# EAGLE design Kombisensor_UP_BA (EAGLE 5.00)
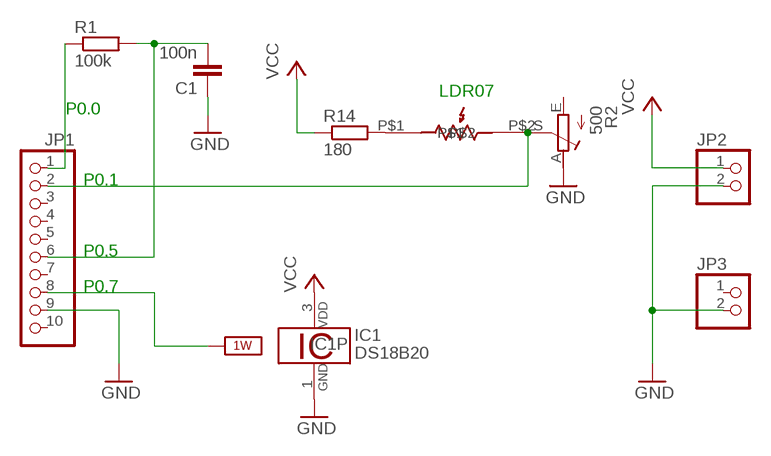
[diagram p0: schematic, sheet 1]

## Parts
C1  100n  C-EU050-024X044  [C050-024X044]
IC1  DS18B20  [TO92-]
JP1  PINHD-1X10  [1X10]
JP2  PINHD-1X2  [1X02]
JP3  PINHD-1X2  [1X02]
LDR1  LDR07  [LDR07]
R1  100k  R-EU_0207/10  [0207/10@1]
R2  500  R-TRIMM-PT6L  [PT6L]
R14  180  R-EU_0207/10  [0207/10@1]

## Nets
1W: JP1.8 ; supply symbol labelled 1W_SUP
GND: C1.1 IC1.1 JP1.9 JP2.2 JP3.2 R2.A
N$1: C1.2 JP1.6 R1.2
N$2: JP1.2 LDR1.P$2 R2.S
N$3: JP1.1 R1.1
N$4: LDR1.P$1 R14.2
VCC: IC1.3 JP2.1 R14.1
Unconnected: JP1.3 JP1.4 JP1.5 JP1.7 JP1.10 JP3.1 R2.E

## Notes on the sheet
- LDR07
- P0.0
- P0.1
- P0.5
- P0.7

## Power pins joined to a net without a drawn wire
1W: IC1.2

## Library data of the parts
C1 = rcl:C-EU: CAPACITOR, European symbol
IC1 = 1wire:DS18B20: Programmable Resolution Digital Thermometer This chip provides a onewire thermosensor with approx. 0.5°C accuracy. A programmable over/undertemperure alarm is available. The precision can be set from 9..12 bits. Notes: Vdd must be applied for accurate measurements at low temperatures, as the parasite power circuit otherwise heats the sensor. If parasite power is used, Vdd has to be connected to GND. The DS1822 is a low-cost thermometer chip, the DS18S20 is similar to the DS18B20, but with 9 Bit precision only. Author: Jan Kandziora <jjj@gmx.de>
JP1 = pinhead:PINHD-1X10: PIN HEADER
JP2 JP3 = pinhead:PINHD-1X2: PIN HEADER
LDR1 = ldr:LDR07
R1 R14 = rcl:R-EU_: RESISTOR, European symbol
R2 = kubi:R-TRIMM

## Board
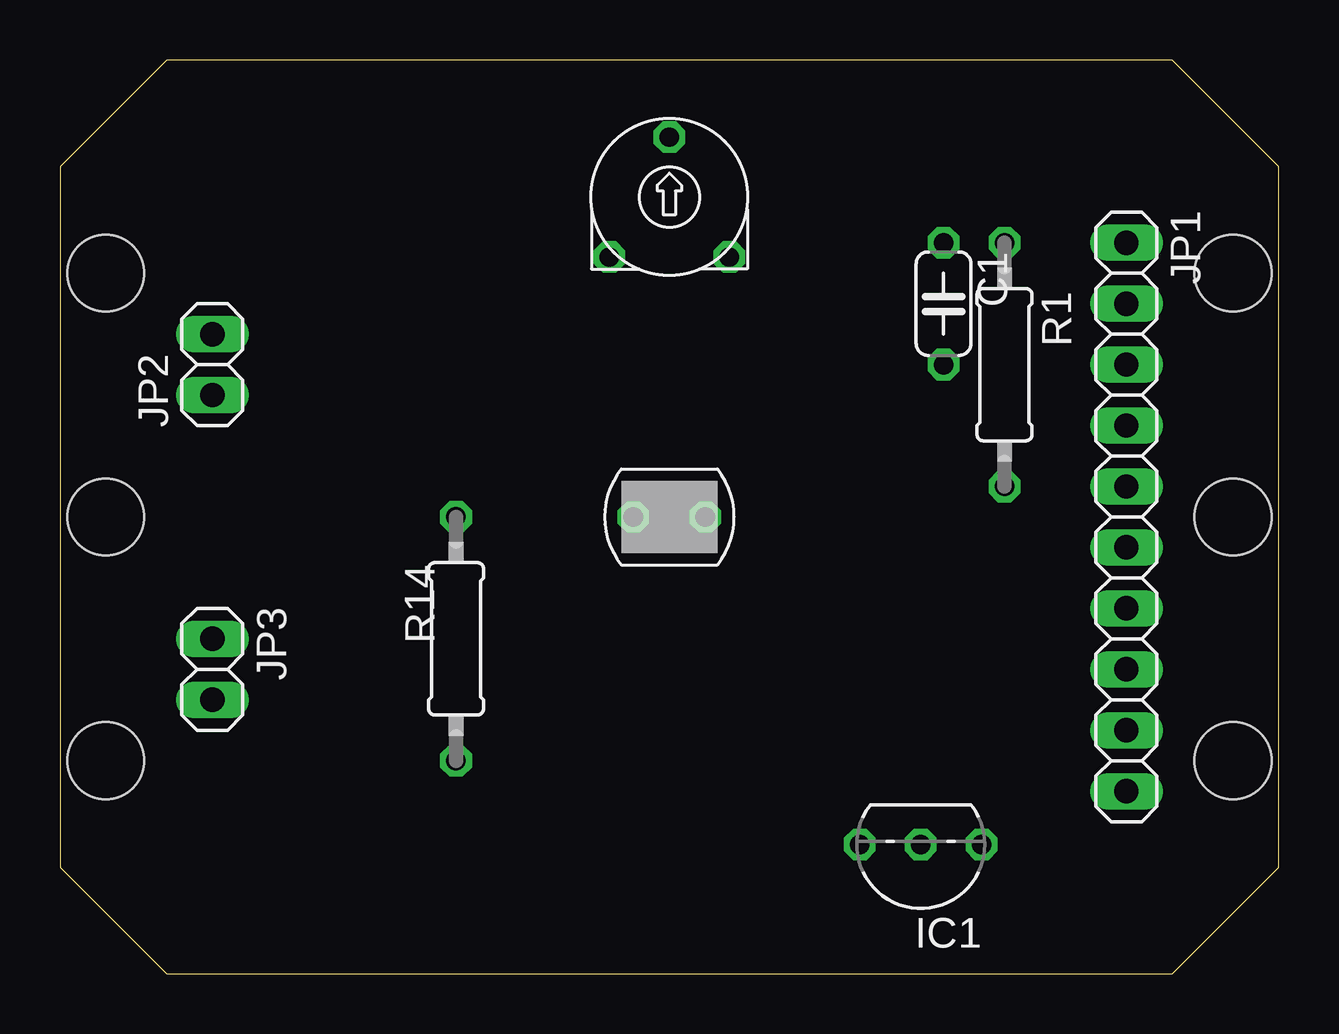
[diagram p1: board, top side]
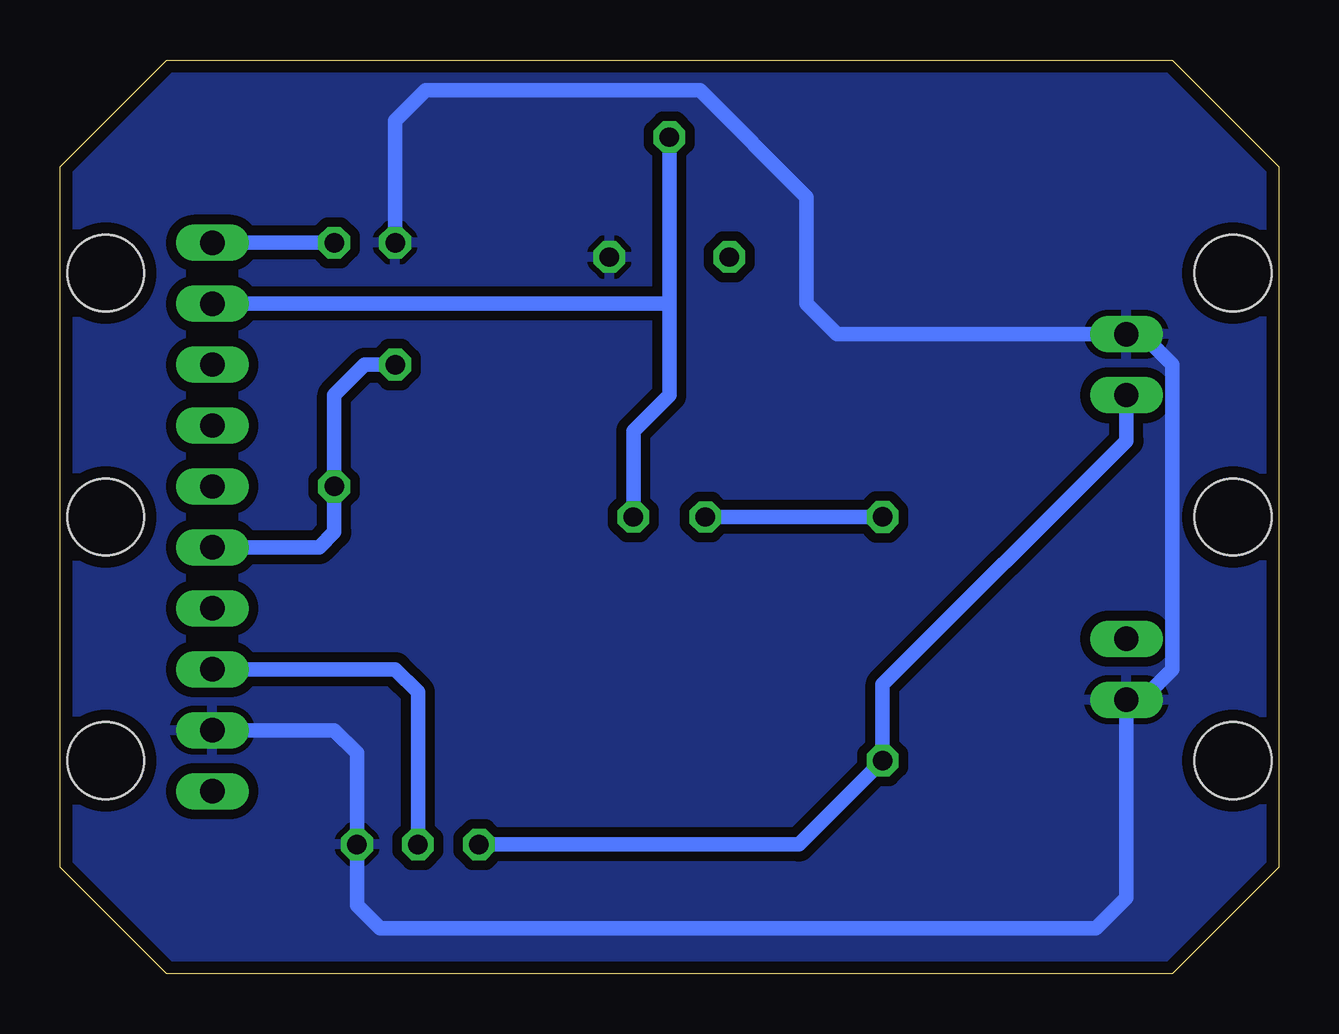
[diagram p2: board, bottom side, seen from below]

Size 50.8 x 38.1 mm. Coordinates in mm from the lower left corner, seen from the top.
Outline: 0,4.45 4.45,0 46.35,0 50.8,4.45 50.8,33.66 46.35,38.1 4.45,38.1 0,33.66 0,4.45
Copper layers (1*16): Top 0.035mm / dielectric 1.5mm / Bottom 0.035mm
Design rules "default *": minimum track width 10mil, minimum drill 24mil, track to track 16mil, track to pad 16mil, pad to pad 16mil, via to via 16mil, smd to smd 8mil, copper to edge 20mil, drill to drill 8mil, minimum pad ring 10mil, minimum via ring 8mil, stop-mask expansion 4mil, vias tented up to drill 0mil, thermal gap 10mil
Holes 3.2 mm at 1.91,19.05 1.91,29.21 1.91,8.89 48.9,19.05 48.9,29.21 48.9,8.89

### Footprints (pad centres in the part's own frame; a part is rotated, then mirrored left to right if it is on the bottom)
C050-024X044 = drill 0.813 octagon: 1 -2.54,0; 2 2.54,0
TO92- = drill 0.813 octagon: 1 -2.54,0; 2 0,0; 3 2.54,0
1X10 = drill 1.016 long: 1 -11.43,0; 2 -8.89,0; 3 -6.35,0; 4 -3.81,0; 5 -1.27,0; 6 1.27,0; 7 3.81,0; 8 6.35,0; 9 8.89,0; 10 11.43,0
1X02 = drill 1.016 long: 1 -1.27,0; 2 1.27,0
LDR07 = drill 0.8 octagon: P$1 -1.5,0; P$2 1.5,0
0207/10@1 = drill 0.813 octagon: 1 -5.08,0; 2 5.08,0
PT6L = drill 0.8 octagon: A 2.5,2.5; E 2.5,-2.5; S -2.5,0

### Placement (x,y rotation side)
C1  36.83,27.94 270 top
IC1  35.88,5.4 180 top
JP1  44.45,19.05 270 top
JP2  6.35,25.4 90 top
JP3  6.35,12.7 270 top
LDR1  25.4,19.05 0 top
R1  39.37,25.4 270 top
R2  25.4,32.38 270 top
R14  16.51,13.97 90 top

### Tracks (layer width: path | path; a pad name or v marks a point on that pad's centre or on a via)
1W
  Bottom 0.61: IC1.2 35.88,11.75 36.83,12.7 JP1.8
GND
  Bottom 0.61: JP1.9 39.37,10.16 38.42,9.21 IC1.1 38.42,2.86 37.47,1.91 7.62,1.91 6.35,3.17 JP3.2 5.71,11.43 4.45,12.7 4.45,25.4 5.71,26.67 JP2.2 18.41,26.67 19.68,27.94 19.68,32.38 24.13,36.83 35.56,36.83 36.83,35.56 C1.1
  pour Bottom: 0,4.45 0,33.66 4.45,38.1 46.35,38.1 50.8,33.66 50.8,4.45 46.35,0 4.45,0
N$1
  Bottom 0.61: JP1.6 40.01,17.78 39.37,18.41 R1.2 39.37,24.13 38.1,25.4 C1.2
N$2
  Bottom 0.61: 25.4,27.94 25.4,24.13 26.9,22.63 LDR1.P$2 | 25.4,27.94 JP1.2 | 25.4,34.92 R2.S 25.4,27.94
N$3
  Bottom 0.61: R1.1 JP1.1
N$4
  Bottom 0.61: R14.2 LDR1.P$1
VCC
  Bottom 0.61: JP2.1 6.35,22.23 16.51,12.06 R14.1 20,5.4 IC1.3